# EAGLE design uklad_zas_bateria (EAGLE 6.3)
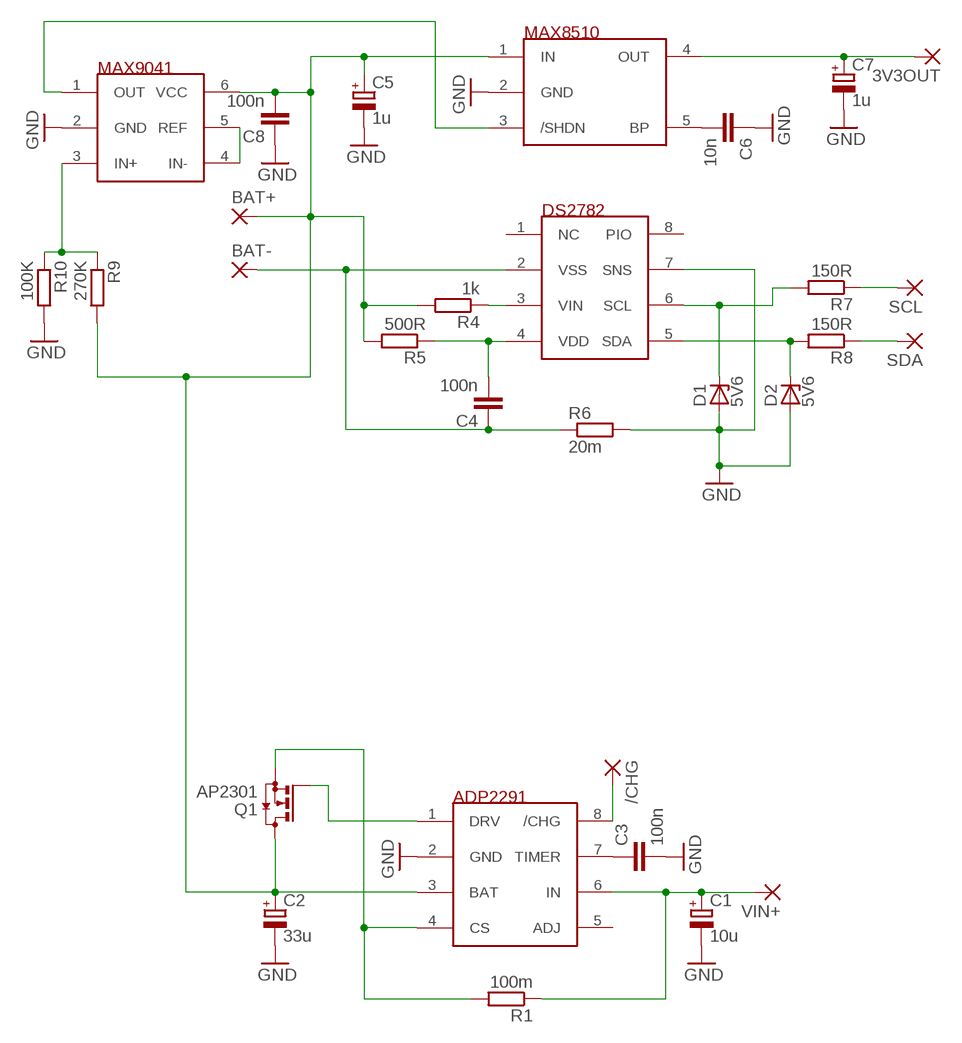
[diagram p0: schematic, sheet 1]

## Parts
3V3OUT  2,54/0,8  [2,54/0,8]
/CHG  2,54/0,8  [2,54/0,8]
BAT+  2,54/0,8  [2,54/0,8]
BAT-  2,54/0,8  [2,54/0,8]
C1  10u  CPOL-EUE2-5  [E2-5]
C2  33u  CPOL-EUE2-5  [E2-5]
C3  100n  C-EUC0805  [C0805]
C4  100n  C-EUC0805  [C0805]
C5  1u  CPOL-EUE2-5  [E2-5]
C6  10n  C-EUC0603  [C0603]
C7  1u  CPOL-EUE2-5  [E2-5]
C8  100n  C-EUC0805  [C0805]
D1  5V6  ZENER-DIODESOD80C  [SOD80C]
D2  5V6  ZENER-DIODESOD80C  [SOD80C]
Q1  AP2301  BSS123  [SOT23]
R1  100m  R-EU_0207/10  [0207/10]
R4  1k  R-EU_M0805  [M0805]
R5  500R  R-EU_M0805  [M0805]
R6  20m  R-EU_M1206  [M1206]
R7  150R  R-EU_M0805  [M0805]
R8  150R  R-EU_M0805  [M0805]
R9  270K  R-EU_M0805  [M0805]
R10  100K  R-EU_M0805  [M0805]
SCL  2,54/0,8  [2,54/0,8]
SDA  2,54/0,8  [2,54/0,8]
U$1  ADP2291  [MSOP8]
U$3  DS2782  [TSSOP8]
U$4  MAX8510  [SC70-5L]
U$5  MAX9041  [SOT23-6]
VIN+  2,54/0,8  [2,54/0,8]

## Nets
GND: C1.- C2.- C3.2 C5.- C6.1 C7.- C8.1 D1.A D2.A R6.2 R10.2 U$1.2(GND) U$3.7(SNS) U$4.2(GND) U$5.2(GND)
N$1: Q1.1(G) U$1.1(DRV)
N$2: Q1.2(S) R1.2 U$1.4(CS)
N$3: C1.+ R1.1 U$1.6(IN) VIN+.1(P)
N$4: /CHG.1(P) U$1.8(/CHG)
N$5: C6.2 U$4.5(BP)
N$6: C3.1 U$1.7(TIMER)
N$8: C4.2 R5.1 U$3.4(VDD)
N$9: BAT-.1(P) C4.1 R6.1 U$3.2(VSS)
N$10: R7.1 SCL.1(P)
N$11: R4.1 U$3.3(VIN)
N$12: R8.1 SDA.1(P)
N$13: D1.C R7.2 U$3.6(SCL)
N$14: D2.C R8.2 U$3.5(SDA)
N$15: U$4.3(/SHDN) U$5.1(OUT)
N$17: 3V3OUT.1(P) C7.+ U$4.4(OUT)
N$18: U$5.4(IN-) U$5.5(REF)
N$19: BAT+.1(P) C2.+ C5.+ C8.2 Q1.3(D) R4.2 R5.2 R9.2 U$1.3(BAT) U$4.1(IN) U$5.6(VCC)
N$21: R9.1 R10.1 U$5.3(IN+)
Unconnected: U$1.5(ADJ) U$3.1(NC) U$3.8(PIO)

## Library data of the parts
3V3OUT /CHG BAT+ BAT- SCL SDA VIN+ = wirepad:2,54/0,8: THROUGH-HOLE PAD
C1 C2 C5 C7 = rcl:CPOL-EU: POLARIZED CAPACITOR, European symbol
C3 C4 C6 C8 = rcl:C-EU: CAPACITOR, European symbol
D1 D2 = diode:ZENER-DIODE: Z-Diode
Q1 = transistor-small-signal:BSS123: N-CHANNEL MOS FET
R1 = rcl:R-EU_: RESISTOR, European symbol
R4-R10 = resistor:R-EU_: RESISTOR, European symbol
U$1 = ref-packages:ADP2291
U$3 = ref-packages:DS2782
U$4 = ref-packages:MAX8510
U$5 = ref-packages:MAX9041

## Net classes
0 default: clearance 0.7 mm

## Board
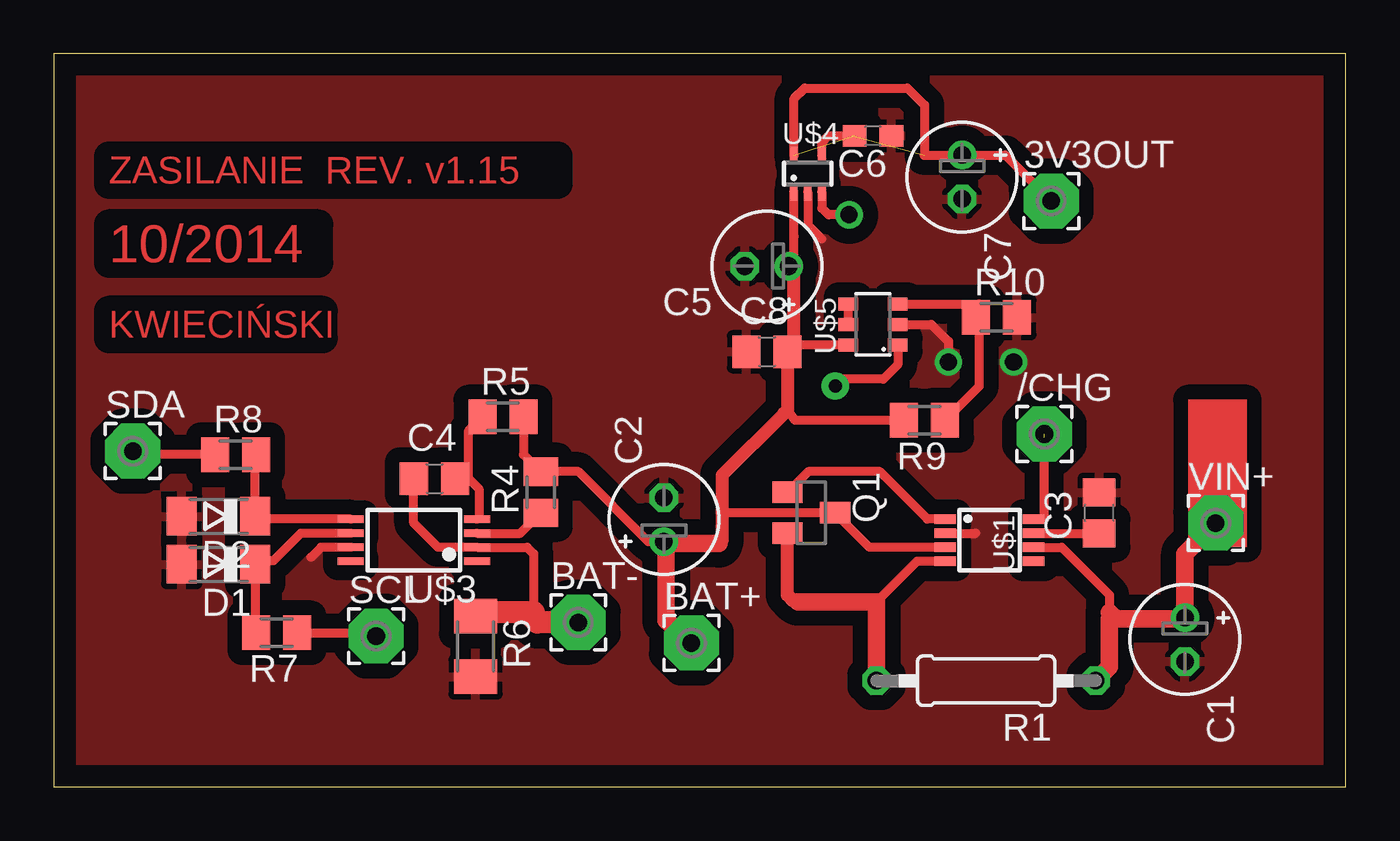
[diagram p1: board, top side]
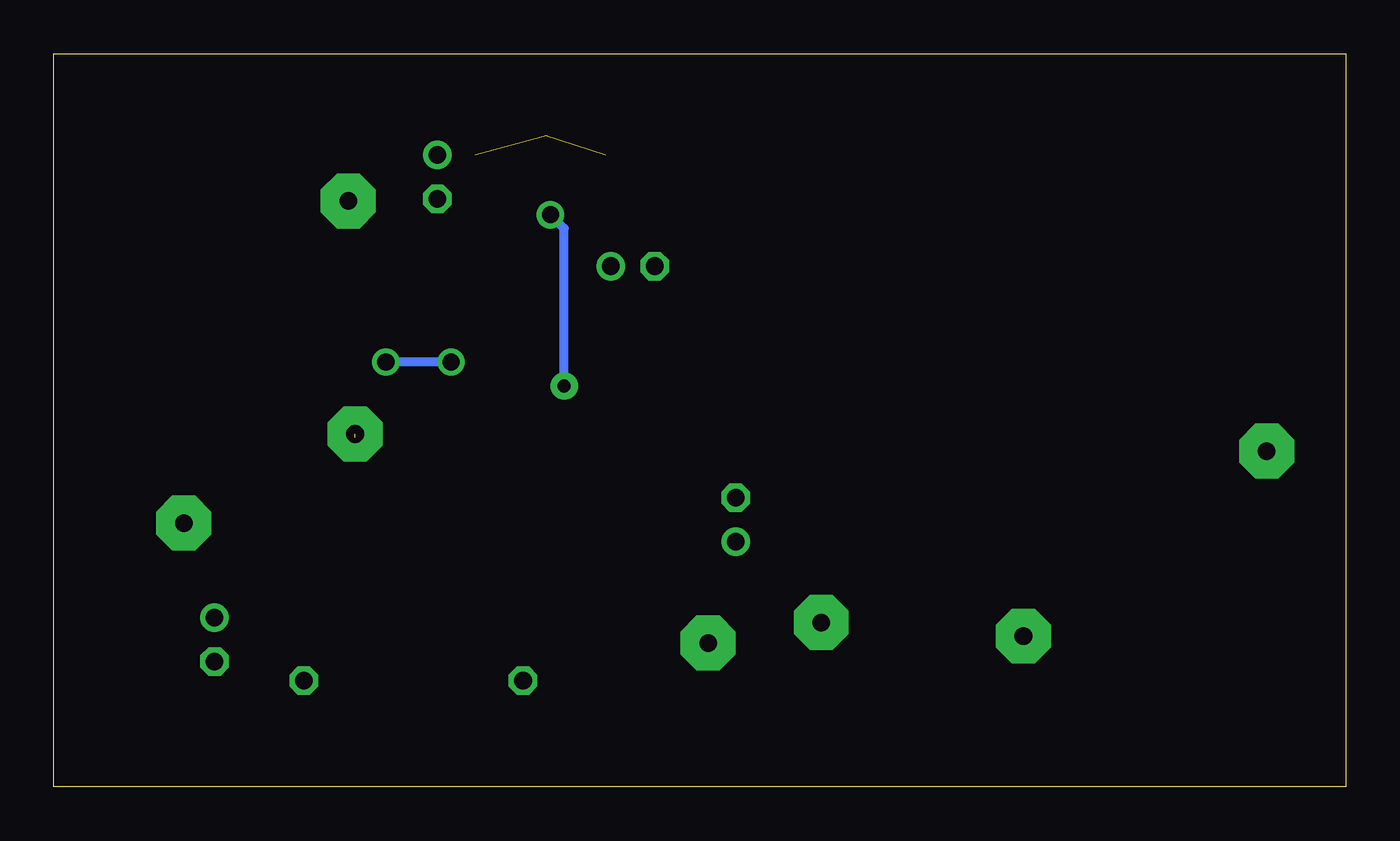
[diagram p2: board, bottom side, seen from below]

Size 59.83 x 33.96 mm. Coordinates in mm from the lower left corner, seen from the top.
Outline: 0,0 59.83,0 59.83,33.96 0,33.96 0,0
Copper layers (1*16): Top 0.035mm / dielectric 1.5mm / Bottom 0.035mm
Design rules "default": minimum track width 10mil, minimum drill 24mil, track to track 8mil, track to pad 8mil, pad to pad 8mil, via to via 8mil, smd to smd 8mil, copper to edge 40mil, drill to drill 8mil, minimum pad ring 10mil, minimum via ring 8mil, stop-mask expansion 4mil, vias tented up to drill 0mil, thermal gap 10mil

### Footprints (pad centres in the part's own frame; a part is rotated, then mirrored left to right if it is on the bottom)
2,54/0,8 = drill 0.813 pad 2.54 octagon: 1 0,0
E2-5 = drill 0.813 pad 1.27: + -1.016,0 | drill 0.813 pad 1.27 octagon: - 1.016,0
C0805 = smd 1.3 x 1.5: 1 -0.95,0; 2 0.95,0
C0603 = smd 1.1 x 1: 1 -0.85,0; 2 0.85,0
SOD80C = smd 1.4 x 1.8: A 1.7,0; C -1.7,0
SOT23 = smd 1 x 1.4: 1 -0.95,-1.1; 2 0.95,-1.1; 3 0,1.1
0207/10 = drill 0.813 octagon: 1 -5.08,0; 2 5.08,0
M0805 = smd 1.3 x 1.6: 1 -0.95,0; 2 0.95,0
M1206 = smd 1.6 x 2: 1 -1.4,0; 2 1.4,0
MSOP8 = smd 0.45 x 1: 1 -0.975,-2.05; 2 -0.325,-2.05; 3 0.325,-2.05; 4 0.975,-2.05; 5 0.975,2.05; 6 0.325,2.05; 7 -0.325,2.05; 8 -0.975,2.05
TSSOP8 = smd 1.2 x 0.35: 1 -2.925,0.975; 2 -2.925,0.325; 3 -2.925,-0.325; 4 -2.925,-0.975; 5 2.925,-0.975; 6 2.925,-0.325; 7 2.925,0.325; 8 2.925,0.975
SC70-5L = smd 0.35 x 0.8: 1 -0.65,-0.85; 2 0,-0.85; 3 0.65,-0.85; 4 0.65,0.85; 5 -0.65,0.85
SOT23-6 = smd 0.6 x 0.9: 1 -0.95,-1.15; 2 0,-1.15; 3 0.95,-1.15; 4 0.95,1.15; 5 0,1.15; 6 -0.95,1.15

### Placement (x,y rotation side)
3V3OUT  46.2,27.15 0 top
/CHG  45.88,16.35 0 top
BAT+  29.53,6.67 0 top
BAT-  24.29,7.62 0 top
C1  52.39,6.83 270 top
C2  28.26,12.38 90 top
C3  48.42,12.7 90 top
C4  17.62,14.29 0 top
C5  33.02,24.13 180 top
C6  37.94,30.16 180 top
C7  42.07,28.26 270 top
C8  33.02,20.16 0 top
D1  7.62,10.32 180 top
D2  7.62,12.54 180 top
Q1  35.08,12.7 270 top
R1  43.18,4.92 180 top
R4  22.54,13.65 90 top
R5  20.8,17.14 0 top
R6  19.53,6.51 270 top
R7  10.32,7.14 180 top
R8  8.41,15.4 0 top
R9  40.32,16.99 180 top
R10  43.66,21.75 0 top
SCL  14.92,6.99 0 top
SDA  3.65,15.56 0 top
U$1  43.34,11.43 270 top
U$3  16.67,11.43 180 top
U$4  34.92,28.42 0 top
U$5  37.94,21.43 90 top
VIN+  53.82,12.22 0 top

### Tracks (layer width: path | path; a pad name or v marks a point on that pad's centre or on a via)
GND  (via drill 0.8 pad 1.27)
  Top 0.406: U$3.7 12.37,11.11 11.91,10.64 | U$4.2 34.92,26.04 35.56,25.4 | U$1.2 42.7,11.76 42.7,11.75 | U$5.2 40.64,21.43 41.43,20.64 v41.43,19.68 | v44.45,19.68 44.45,19.84
  Bottom 0.406: v41.43,19.68 v44.45,19.68
  pour Top: -5.71,-0.32 59.85,0 59.85,34.29 -5.71,33.97
N$1
  Top 0.406: U$1.1 40.46,12.4 38.26,14.61 34.94,14.61 Q1.1
N$2
  Top 0.406: U$1.4 39.98,10.46 38.1,8.57
  Top 0.61: 34.46,8.57 34.29,8.57 33.97,8.89 Q1.2
  Top 0.813: R1.2 38.1,8.57 34.46,8.57
N$3
  Top 0.406: U$1.6 46.68,11.11 48.89,8.89 48.89,8.1 48.89,7.78
  Top 0.813: VIN+.1 52.39,10.79 C1.+ 52.32,7.78 49.21,7.78 48.89,8.1 | 48.89,7.78 48.89,5.56 R1.1
N$4  (1 unrouted)
  Top 0.406: U$1.8 45.88,12.4 45.88,16.19
N$5  (1 unrouted)
  Top 0.406: U$4.5 34.29,29.27 34.29,31.91 34.77,32.38 39.53,32.38 40.32,31.59 40.32,29.37
N$6
  Top 0.406: U$1.7 C3.1
N$8
  Top 0.406: C4.2 19.21,14.29 | 19.21,14.29 19.68,13.81 19.68,12.5 U$3.4 | 19.21,14.29 19.21,16.51 R5.1
N$9
  Top 0.406: 19.71,8.1 R6.1 | 22.22,8.1 22.22,10.79 21.91,11.11 U$3.2 17.79,11.11 16.67,12.22 C4.1
  Top 0.813: 22.38,7.62 22.22,7.78
  Top 1.016: BAT-.1 22.38,7.62 | 22.22,7.78 22.22,8.1 19.71,8.1
N$10
  Top 0.406: R7.1 14.76,7.14 SCL.1
N$11
  Top 0.406: U$3.3 21.59,11.76 R4.1
N$12
  Top 0.406: R8.1 4.29,15.4 | 3.49,15.4 4.29,15.4 | 4.29,15.4 SDA.1
N$13
  Top 0.406: U$3.6 11.44,11.76 10.16,10.48 9.48,10.48 D1.C 9.32,7.19 R7.2
N$14
  Top 0.406: R8.2 9.32,15.36 D2.C 9.46,12.4 U$3.5
N$15  (via drill 0.6 pad 1.27, 0.8 pad 1.27)
  Top 0.406: U$5.1 39.09,19.57 38.42,18.89 36.51,18.89 v36.19,18.57 | v36.83,26.51 35.88,26.51 35.57,26.81 U$4.3
  Bottom 0.406: v36.19,18.57 36.19,25.88 v36.83,26.51
N$17  (1 unrouted)
  Top 0.406: 40.31,29.27 C7.+ 44.07,29.27 3V3OUT.1 | U$4.4 35.57,29.86 35.88,30.16 36.99,30.16
N$18
  Top 0.406: U$5.5 U$5.4
N$19
  Top 0.406: 28.35,11.27 C2.+ 27.53,11.37 24.29,14.61 R4.2 21.75,15.4 R5.2 | 33.81,17.3 33.98,17.49 34.33,16.99 R9.2 | 30.96,11.43 30.8,11.27 | U$5.6 34.29,20.48 C8.2 | U$4.1 34.29,25.52 34.29,23.97 34.13,24.13 C5.+ | U$1.3 37.78,11.11 Q1.3 30.96,12.7
  Top 0.61: C8.2 33.98,17.49 | 33.81,17.3 30.96,14.45 30.96,12.7 30.96,11.43 | 34.29,20.48 34.29,23.97
  Top 0.813: 30.8,11.27 28.35,11.27 28.35,7.71 BAT+.1
N$21
  Top 0.406: U$5.3 42.86,22.38 R10.1 42.86,22.07 42.86,18.57 R9.1
(copper drawn outside any net)
  shapes: Top area x1

### Text on the board
Top: ZASILANIE REV. v1.15 | 10/2014 | KWIECIŃSKI